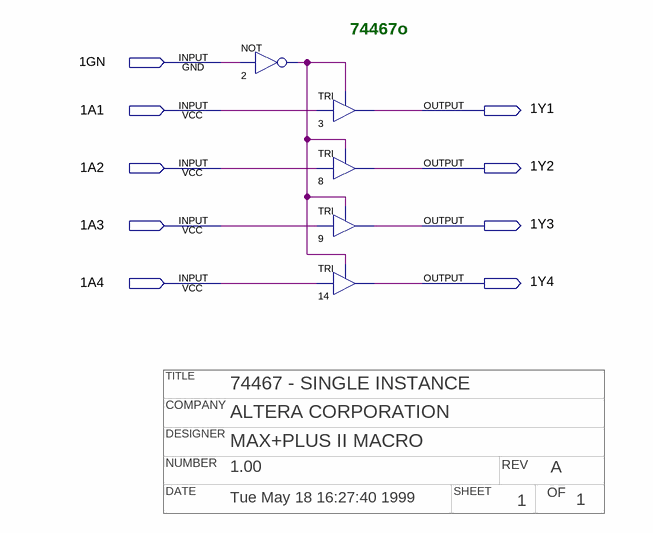
[diagram p0: schematic sheet]
// Quartus schematic 74467o.bdf as structural Verilog: 5 symbols, 9 pins
// Title block: TITLE: 74467 - SINGLE INSTANCE; COMPANY: ALTERA CORPORATION; DESIGNER: MAX+PLUS II MACRO; NUMBER: 1.00; REV: A; DATE: Tue May 18 16:27:40 1999; SHEET: 1; OF: 1
module \74467o  (
  input  \1GN ,
  input  \1A1 ,
  input  \1A2 ,
  input  \1A3 ,
  input  \1A4 ,
  output \1Y1 ,
  output \1Y2 ,
  output \1Y3 ,
  output \1Y4 
);

  wire n2_out;

  not u_2 (n2_out, \1GN );
  TRI u_3 (.IN(\1A1 ), .OE(n2_out), .OUT(\1Y1 ));
  TRI u_8 (.IN(\1A2 ), .OE(n2_out), .OUT(\1Y2 ));
  TRI u_9 (.IN(\1A3 ), .OE(n2_out), .OUT(\1Y3 ));
  TRI u_14 (.IN(\1A4 ), .OE(n2_out), .OUT(\1Y4 ));

  // Notes on the sheet:
  //   74467o
endmodule
